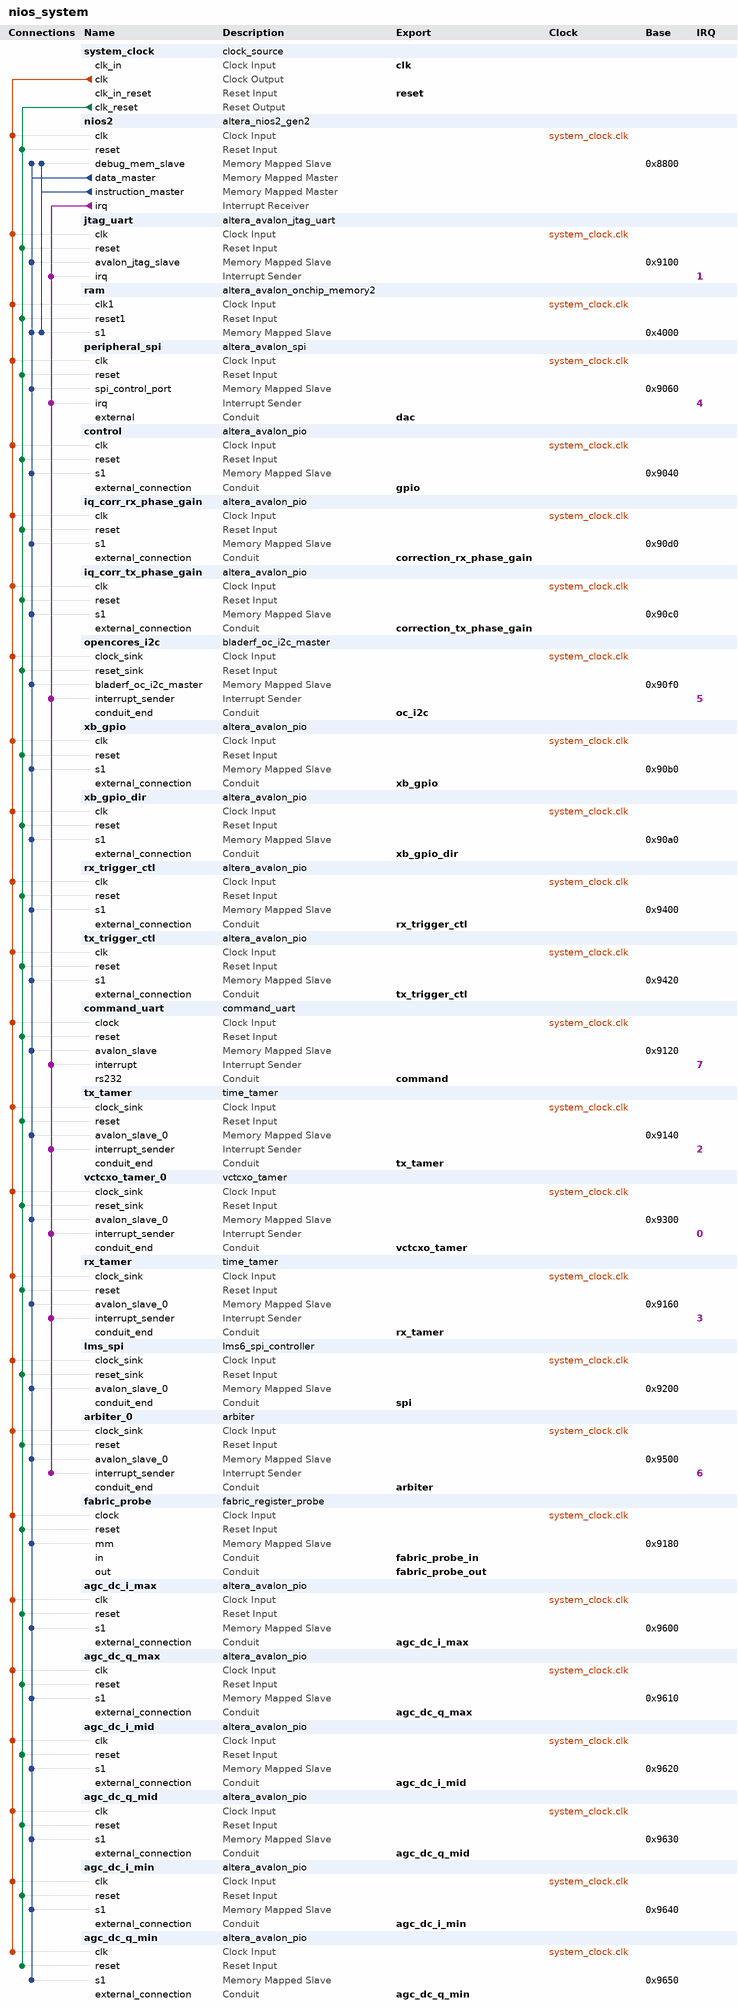
[diagram p0: system contents]
# Platform Designer (Qsys) system nios_system, Cyclone IV E EP4CE115F23C8
# Parameters at their usual value, and those the tool derives, are not listed.
package require -exact qsys 17.0
create_system nios_system
set_project_property DEVICE_FAMILY {Cyclone IV E}
set_project_property DEVICE EP4CE115F23C8

add_instance system_clock clock_source 17.0
set_instance_parameter_value system_clock clockFrequency 80000000
set_instance_parameter_value system_clock resetSynchronousEdges DEASSERT

add_instance nios2 altera_nios2_gen2 17.0
set_instance_parameter_value nios2 dcache_size 2048
set_instance_parameter_value nios2 dividerType srt2
set_instance_parameter_value nios2 exceptionSlave ram.s1
set_instance_parameter_value nios2 icache_size 2048
set_instance_parameter_value nios2 impl Tiny
set_instance_parameter_value nios2 mul_64_impl 1
set_instance_parameter_value nios2 mul_shift_choice 1
set_instance_parameter_value nios2 resetSlave ram.s1
set_instance_parameter_value nios2 setting_activateTrace true

add_instance jtag_uart altera_avalon_jtag_uart 17.0
set_instance_parameter_value jtag_uart simInteractiveOptions INTERACTIVE_INPUT_OUTPUT

add_instance ram altera_avalon_onchip_memory2 17.0
set_instance_parameter_value ram allowInSystemMemoryContentEditor true
set_instance_parameter_value ram dataWidth 32
set_instance_parameter_value ram dualPort false
set_instance_parameter_value ram initMemContent true
set_instance_parameter_value ram initializationFileName onchip_memory2_0
set_instance_parameter_value ram instanceID MED
set_instance_parameter_value ram memorySize 16384

add_instance peripheral_spi altera_avalon_spi 17.0
set_instance_parameter_value peripheral_spi clockPhase 1
set_instance_parameter_value peripheral_spi clockPolarity 1
set_instance_parameter_value peripheral_spi dataWidth 8
set_instance_parameter_value peripheral_spi masterSPI true
set_instance_parameter_value peripheral_spi numberOfSlaves 2
set_instance_parameter_value peripheral_spi targetClockRate 9600000

add_instance control altera_avalon_pio 17.0
set_instance_parameter_value control bitModifyingOutReg true
set_instance_parameter_value control direction Output
set_instance_parameter_value control width 32

add_instance iq_corr_rx_phase_gain altera_avalon_pio 17.0
set_instance_parameter_value iq_corr_rx_phase_gain direction Output
set_instance_parameter_value iq_corr_rx_phase_gain width 32

add_instance iq_corr_tx_phase_gain altera_avalon_pio 17.0
set_instance_parameter_value iq_corr_tx_phase_gain direction Output
set_instance_parameter_value iq_corr_tx_phase_gain resetValue 1
set_instance_parameter_value iq_corr_tx_phase_gain width 32

add_instance opencores_i2c bladerf_oc_i2c_master 1.0
set_instance_parameter_value opencores_i2c ARST_LVL 1

add_instance xb_gpio altera_avalon_pio 17.0
set_instance_parameter_value xb_gpio direction InOut
set_instance_parameter_value xb_gpio width 32

add_instance xb_gpio_dir altera_avalon_pio 17.0
set_instance_parameter_value xb_gpio_dir direction Output
set_instance_parameter_value xb_gpio_dir width 32

add_instance rx_trigger_ctl altera_avalon_pio 17.0
set_instance_parameter_value rx_trigger_ctl bitModifyingOutReg true
set_instance_parameter_value rx_trigger_ctl direction InOut
set_instance_parameter_value rx_trigger_ctl width 8

add_instance tx_trigger_ctl altera_avalon_pio 17.0
set_instance_parameter_value tx_trigger_ctl bitModifyingOutReg true
set_instance_parameter_value tx_trigger_ctl direction InOut
set_instance_parameter_value tx_trigger_ctl width 8

add_instance command_uart command_uart 1.0

add_instance tx_tamer time_tamer 1.0

add_instance vctcxo_tamer_0 vctcxo_tamer 1.0

add_instance rx_tamer time_tamer 1.0

add_instance lms_spi lms6_spi_controller 1.0
set_instance_parameter_value lms_spi ADDR_WIDTH 8
set_instance_parameter_value lms_spi CLOCK_DIV 4
set_instance_parameter_value lms_spi DATA_WIDTH 8

add_instance arbiter_0 arbiter 1.0
set_instance_parameter_value arbiter_0 N 2

add_instance fabric_probe fabric_register_probe 1.0
set_instance_parameter_value fabric_probe enable_inputs true
set_instance_parameter_value fabric_probe enable_outputs true

add_instance agc_dc_i_max altera_avalon_pio 17.0
set_instance_parameter_value agc_dc_i_max direction Output
set_instance_parameter_value agc_dc_i_max width 16

add_instance agc_dc_q_max altera_avalon_pio 17.0
set_instance_parameter_value agc_dc_q_max direction Output
set_instance_parameter_value agc_dc_q_max width 16

add_instance agc_dc_i_mid altera_avalon_pio 17.0
set_instance_parameter_value agc_dc_i_mid direction Output
set_instance_parameter_value agc_dc_i_mid width 16

add_instance agc_dc_q_mid altera_avalon_pio 17.0
set_instance_parameter_value agc_dc_q_mid direction Output
set_instance_parameter_value agc_dc_q_mid width 16

add_instance agc_dc_i_min altera_avalon_pio 17.0
set_instance_parameter_value agc_dc_i_min direction Output
set_instance_parameter_value agc_dc_i_min width 16

add_instance agc_dc_q_min altera_avalon_pio 17.0
set_instance_parameter_value agc_dc_q_min direction Output
set_instance_parameter_value agc_dc_q_min width 16

# connections
add_connection system_clock.clk agc_dc_i_max.clk clock
add_connection system_clock.clk agc_dc_i_mid.clk clock
add_connection system_clock.clk agc_dc_i_min.clk clock
add_connection system_clock.clk agc_dc_q_max.clk clock
add_connection system_clock.clk agc_dc_q_mid.clk clock
add_connection system_clock.clk agc_dc_q_min.clk clock
add_connection system_clock.clk arbiter_0.clock_sink clock
add_connection system_clock.clk command_uart.clock clock
add_connection system_clock.clk control.clk clock
add_connection system_clock.clk fabric_probe.clock clock
add_connection system_clock.clk iq_corr_rx_phase_gain.clk clock
add_connection system_clock.clk iq_corr_tx_phase_gain.clk clock
add_connection system_clock.clk jtag_uart.clk clock
add_connection system_clock.clk lms_spi.clock_sink clock
add_connection system_clock.clk nios2.clk clock
add_connection system_clock.clk opencores_i2c.clock_sink clock
add_connection system_clock.clk peripheral_spi.clk clock
add_connection system_clock.clk ram.clk1 clock
add_connection system_clock.clk rx_tamer.clock_sink clock
add_connection system_clock.clk rx_trigger_ctl.clk clock
add_connection system_clock.clk tx_tamer.clock_sink clock
add_connection system_clock.clk tx_trigger_ctl.clk clock
add_connection system_clock.clk vctcxo_tamer_0.clock_sink clock
add_connection system_clock.clk xb_gpio.clk clock
add_connection system_clock.clk xb_gpio_dir.clk clock
add_connection system_clock.clk_reset agc_dc_i_max.reset reset
add_connection system_clock.clk_reset agc_dc_i_mid.reset reset
add_connection system_clock.clk_reset agc_dc_i_min.reset reset
add_connection system_clock.clk_reset agc_dc_q_max.reset reset
add_connection system_clock.clk_reset agc_dc_q_mid.reset reset
add_connection system_clock.clk_reset agc_dc_q_min.reset reset
add_connection system_clock.clk_reset arbiter_0.reset reset
add_connection system_clock.clk_reset command_uart.reset reset
add_connection system_clock.clk_reset control.reset reset
add_connection system_clock.clk_reset fabric_probe.reset reset
add_connection system_clock.clk_reset iq_corr_rx_phase_gain.reset reset
add_connection system_clock.clk_reset iq_corr_tx_phase_gain.reset reset
add_connection system_clock.clk_reset jtag_uart.reset reset
add_connection system_clock.clk_reset lms_spi.reset_sink reset
add_connection system_clock.clk_reset nios2.reset reset
add_connection system_clock.clk_reset opencores_i2c.reset_sink reset
add_connection system_clock.clk_reset peripheral_spi.reset reset
add_connection system_clock.clk_reset ram.reset1 reset
add_connection system_clock.clk_reset rx_tamer.reset reset
add_connection system_clock.clk_reset rx_trigger_ctl.reset reset
add_connection system_clock.clk_reset tx_tamer.reset reset
add_connection system_clock.clk_reset tx_trigger_ctl.reset reset
add_connection system_clock.clk_reset vctcxo_tamer_0.reset_sink reset
add_connection system_clock.clk_reset xb_gpio.reset reset
add_connection system_clock.clk_reset xb_gpio_dir.reset reset
add_connection nios2.data_master agc_dc_i_max.s1 avalon
set_connection_parameter_value nios2.data_master/agc_dc_i_max.s1 baseAddress 0x9600
add_connection nios2.data_master agc_dc_i_mid.s1 avalon
set_connection_parameter_value nios2.data_master/agc_dc_i_mid.s1 baseAddress 0x9620
add_connection nios2.data_master agc_dc_i_min.s1 avalon
set_connection_parameter_value nios2.data_master/agc_dc_i_min.s1 baseAddress 0x9640
add_connection nios2.data_master agc_dc_q_max.s1 avalon
set_connection_parameter_value nios2.data_master/agc_dc_q_max.s1 baseAddress 0x9610
add_connection nios2.data_master agc_dc_q_mid.s1 avalon
set_connection_parameter_value nios2.data_master/agc_dc_q_mid.s1 baseAddress 0x9630
add_connection nios2.data_master agc_dc_q_min.s1 avalon
set_connection_parameter_value nios2.data_master/agc_dc_q_min.s1 baseAddress 0x9650
add_connection nios2.data_master arbiter_0.avalon_slave_0 avalon
set_connection_parameter_value nios2.data_master/arbiter_0.avalon_slave_0 baseAddress 0x9500
add_connection nios2.data_master command_uart.avalon_slave avalon
set_connection_parameter_value nios2.data_master/command_uart.avalon_slave baseAddress 0x9120
add_connection nios2.data_master control.s1 avalon
set_connection_parameter_value nios2.data_master/control.s1 baseAddress 0x9040
add_connection nios2.data_master fabric_probe.mm avalon
set_connection_parameter_value nios2.data_master/fabric_probe.mm baseAddress 0x9180
add_connection nios2.data_master iq_corr_rx_phase_gain.s1 avalon
set_connection_parameter_value nios2.data_master/iq_corr_rx_phase_gain.s1 baseAddress 0x90d0
add_connection nios2.data_master iq_corr_tx_phase_gain.s1 avalon
set_connection_parameter_value nios2.data_master/iq_corr_tx_phase_gain.s1 baseAddress 0x90c0
add_connection nios2.data_master jtag_uart.avalon_jtag_slave avalon
set_connection_parameter_value nios2.data_master/jtag_uart.avalon_jtag_slave baseAddress 0x9100
add_connection nios2.data_master lms_spi.avalon_slave_0 avalon
set_connection_parameter_value nios2.data_master/lms_spi.avalon_slave_0 baseAddress 0x9200
add_connection nios2.data_master nios2.debug_mem_slave avalon
set_connection_parameter_value nios2.data_master/nios2.debug_mem_slave baseAddress 0x8800
add_connection nios2.data_master opencores_i2c.bladerf_oc_i2c_master avalon
set_connection_parameter_value nios2.data_master/opencores_i2c.bladerf_oc_i2c_master baseAddress 0x90f0
add_connection nios2.data_master peripheral_spi.spi_control_port avalon
set_connection_parameter_value nios2.data_master/peripheral_spi.spi_control_port baseAddress 0x9060
add_connection nios2.data_master ram.s1 avalon
set_connection_parameter_value nios2.data_master/ram.s1 baseAddress 0x4000
add_connection nios2.data_master rx_tamer.avalon_slave_0 avalon
set_connection_parameter_value nios2.data_master/rx_tamer.avalon_slave_0 baseAddress 0x9160
add_connection nios2.data_master rx_trigger_ctl.s1 avalon
set_connection_parameter_value nios2.data_master/rx_trigger_ctl.s1 baseAddress 0x9400
add_connection nios2.data_master tx_tamer.avalon_slave_0 avalon
set_connection_parameter_value nios2.data_master/tx_tamer.avalon_slave_0 baseAddress 0x9140
add_connection nios2.data_master tx_trigger_ctl.s1 avalon
set_connection_parameter_value nios2.data_master/tx_trigger_ctl.s1 baseAddress 0x9420
add_connection nios2.data_master vctcxo_tamer_0.avalon_slave_0 avalon
set_connection_parameter_value nios2.data_master/vctcxo_tamer_0.avalon_slave_0 baseAddress 0x9300
add_connection nios2.data_master xb_gpio.s1 avalon
set_connection_parameter_value nios2.data_master/xb_gpio.s1 baseAddress 0x90b0
add_connection nios2.data_master xb_gpio_dir.s1 avalon
set_connection_parameter_value nios2.data_master/xb_gpio_dir.s1 baseAddress 0x90a0
add_connection nios2.instruction_master nios2.debug_mem_slave avalon
set_connection_parameter_value nios2.instruction_master/nios2.debug_mem_slave baseAddress 0x8800
add_connection nios2.instruction_master ram.s1 avalon
set_connection_parameter_value nios2.instruction_master/ram.s1 baseAddress 0x4000
add_connection nios2.irq arbiter_0.interrupt_sender interrupt
set_connection_parameter_value nios2.irq/arbiter_0.interrupt_sender irqNumber 6
add_connection nios2.irq command_uart.interrupt interrupt
set_connection_parameter_value nios2.irq/command_uart.interrupt irqNumber 7
add_connection nios2.irq jtag_uart.irq interrupt
set_connection_parameter_value nios2.irq/jtag_uart.irq irqNumber 1
add_connection nios2.irq opencores_i2c.interrupt_sender interrupt
set_connection_parameter_value nios2.irq/opencores_i2c.interrupt_sender irqNumber 5
add_connection nios2.irq peripheral_spi.irq interrupt
set_connection_parameter_value nios2.irq/peripheral_spi.irq irqNumber 4
add_connection nios2.irq rx_tamer.interrupt_sender interrupt
set_connection_parameter_value nios2.irq/rx_tamer.interrupt_sender irqNumber 3
add_connection nios2.irq tx_tamer.interrupt_sender interrupt
set_connection_parameter_value nios2.irq/tx_tamer.interrupt_sender irqNumber 2
add_connection nios2.irq vctcxo_tamer_0.interrupt_sender interrupt
set_connection_parameter_value nios2.irq/vctcxo_tamer_0.interrupt_sender irqNumber 0

# exported interfaces
add_interface agc_dc_i_max conduit end
set_interface_property agc_dc_i_max EXPORT_OF agc_dc_i_max.external_connection
add_interface agc_dc_i_mid conduit end
set_interface_property agc_dc_i_mid EXPORT_OF agc_dc_i_mid.external_connection
add_interface agc_dc_i_min conduit end
set_interface_property agc_dc_i_min EXPORT_OF agc_dc_i_min.external_connection
add_interface agc_dc_q_max conduit end
set_interface_property agc_dc_q_max EXPORT_OF agc_dc_q_max.external_connection
add_interface agc_dc_q_mid conduit end
set_interface_property agc_dc_q_mid EXPORT_OF agc_dc_q_mid.external_connection
add_interface agc_dc_q_min conduit end
set_interface_property agc_dc_q_min EXPORT_OF agc_dc_q_min.external_connection
add_interface arbiter conduit end
set_interface_property arbiter EXPORT_OF arbiter_0.conduit_end
add_interface clk clock sink
set_interface_property clk EXPORT_OF system_clock.clk_in
add_interface command conduit end
set_interface_property command EXPORT_OF command_uart.rs232
add_interface correction_rx_phase_gain conduit end
set_interface_property correction_rx_phase_gain EXPORT_OF iq_corr_rx_phase_gain.external_connection
add_interface correction_tx_phase_gain conduit end
set_interface_property correction_tx_phase_gain EXPORT_OF iq_corr_tx_phase_gain.external_connection
add_interface dac conduit end
set_interface_property dac EXPORT_OF peripheral_spi.external
add_interface fabric_probe_in conduit end
set_interface_property fabric_probe_in EXPORT_OF fabric_probe.in
add_interface fabric_probe_out conduit end
set_interface_property fabric_probe_out EXPORT_OF fabric_probe.out
add_interface gpio conduit end
set_interface_property gpio EXPORT_OF control.external_connection
add_interface oc_i2c conduit end
set_interface_property oc_i2c EXPORT_OF opencores_i2c.conduit_end
add_interface reset reset sink
set_interface_property reset EXPORT_OF system_clock.clk_in_reset
add_interface rx_tamer conduit end
set_interface_property rx_tamer EXPORT_OF rx_tamer.conduit_end
add_interface rx_trigger_ctl conduit end
set_interface_property rx_trigger_ctl EXPORT_OF rx_trigger_ctl.external_connection
add_interface spi conduit end
set_interface_property spi EXPORT_OF lms_spi.conduit_end
add_interface tx_tamer conduit end
set_interface_property tx_tamer EXPORT_OF tx_tamer.conduit_end
add_interface tx_trigger_ctl conduit end
set_interface_property tx_trigger_ctl EXPORT_OF tx_trigger_ctl.external_connection
add_interface vctcxo_tamer conduit end
set_interface_property vctcxo_tamer EXPORT_OF vctcxo_tamer_0.conduit_end
add_interface xb_gpio conduit end
set_interface_property xb_gpio EXPORT_OF xb_gpio.external_connection
add_interface xb_gpio_dir conduit end
set_interface_property xb_gpio_dir EXPORT_OF xb_gpio_dir.external_connection

set_interconnect_requirement {$system} qsys_mm.clockCrossingAdapter HANDSHAKE
set_interconnect_requirement {$system} qsys_mm.maxAdditionalLatency 1

save_system nios_system.qsys
